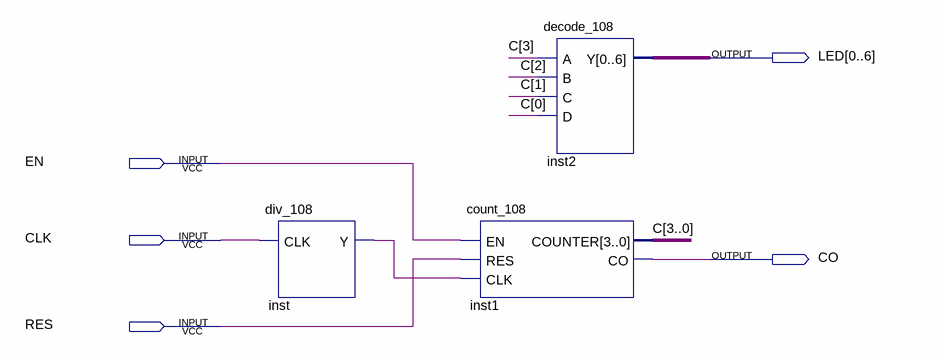
[diagram p0: schematic sheet]
// Quartus schematic top_108.bdf as structural Verilog: 3 symbols, 5 pins
module top_108 (
  input  EN,
  input  CLK,
  input  RES,
  output [0:6] LED,
  output CO
);

  wire inst_y;
  wire [3:0] C;

  div_108 inst (.CLK(CLK), .Y(inst_y));
  count_108 inst1 (.EN(EN), .RES(RES), .CLK(inst_y), .COUNTER(C), .CO(CO));
  decode_108 inst2 (.A(C[3]), .B(C[2]), .C(C[1]), .D(C[0]), .Y(LED));
endmodule
